# EAGLE schematic ESP32_MPU6050 (EAGLE 9.4.0)
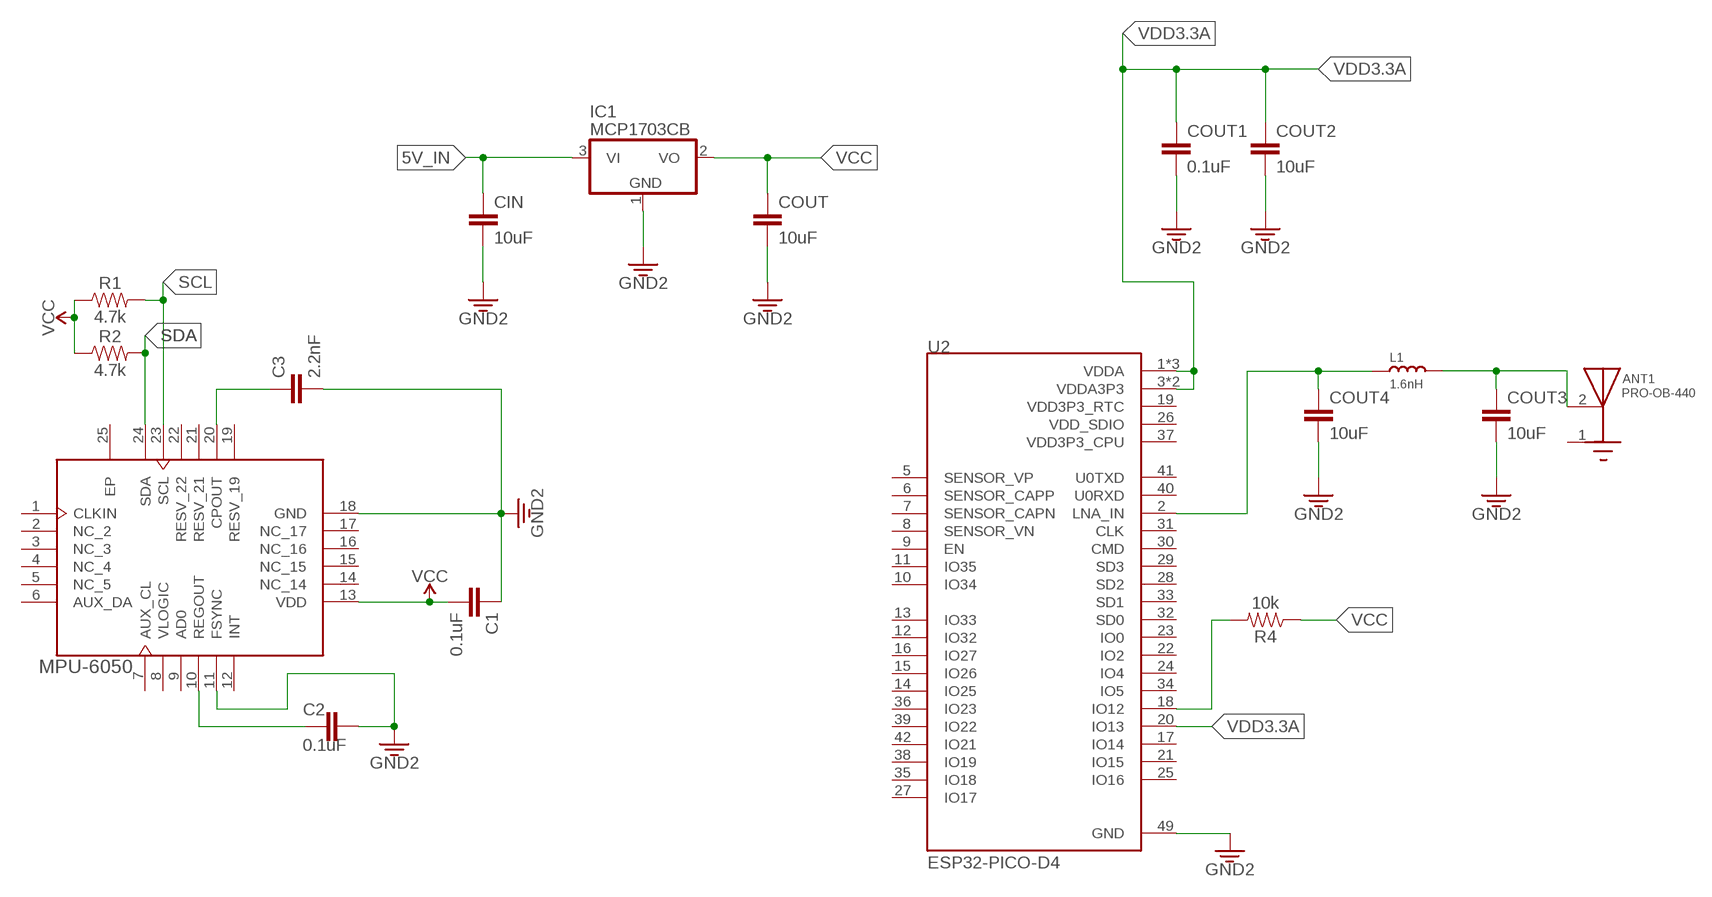
[diagram p0: schematic, sheet 1]

## Parts
ANT1  PRO-OB-440  [ANT_PRO-OB-440]
C1  0.1uF  0.1UF-0603-100V-10%  [0603]
C2  0.1uF  0.1UF-0603-100V-10%  [0603]
C3  2.2nF  2.2NF/2200PF-0603-50V-10%  [0603]
CIN  10uF  0.1UF-0603-100V-10%  [0603]
COUT  10uF  0.1UF-0603-100V-10%  [0603]
COUT1  0.1uF  0.1UF-0603-100V-10%  [0603]
COUT2  10uF  0.1UF-0603-100V-10%  [0603]
COUT3  10uF  0.1UF-0603-100V-10%  [0603]
COUT4  10uF  0.1UF-0603-100V-10%  [0603]
IC1  MCP1703CB  [SOT23]
L1  1.6nH  INDUCTOR_INDUCTOR/FERRITE-BEAD0603  [INDUCTOR_L0603]
R1  4.7k  4.7KOHM-0603-1/10W-1%  [0603]
R2  4.7k  4.7KOHM-0603-1/10W-1%  [0603]
R4  10k  4.7KOHM-0603-1/10W-1%  [0603]
U1  MPU-6050  [24-VFQFN]
U2  ESP32-PICO-D4  [PQFN50P700X700X104-49N]

## Nets
3.3V: C1.1 C2.2 C3.2 CIN.2 COUT1.2 COUT2.2 COUT3.2 COUT4.2 COUT.2 IC1.1(GND) U1.11(FSYNC) U1.18(GND) U2.49(GND) ; supply symbol labelled GND2
5V_IN: CIN.1 IC1.3(VI)
N$1: C3.1 U1.20(CPOUT)
N$2: COUT4.1 L1.1 U2.2(LNA_IN)
N$3: C2.1 U1.10(REGOUT)
N$4: ANT1.2(FEED) COUT3.1 L1.2
N$5: R4.2 U2.18(IO12)
SCL: R1.2 U1.23(SCL)
SDA: R2.2 U1.24(SDA)
VCC: COUT.1 IC1.2(VO) R1.1 R2.1 R4.1
VCC_3.3: C1.2 U1.13(VDD) ; supply symbol labelled VCC
VDD3.3A: COUT1.1 COUT2.1 U2.1(VDDA) U2.3(VDDA3P3) U2.4(VDDA3P3) U2.20(IO13) U2.43(VDDA) U2.46(VDDA)
Unconnected: U1.1(CLKIN) U1.2(NC_2) U1.3(NC_3) U1.4(NC_4) U1.5(NC_5) U1.6(AUX_DA) U1.7(AUX_CL) U1.9(AD0) U1.12(INT) U1.14(NC_14) U1.15(NC_15) U1.16(NC_16) U1.17(NC_17) U1.19(RESV_19) U1.21(RESV_21) U1.22(RESV_22) U2.5(SENSOR_VP) U2.6(SENSOR_CAPP) U2.7(SENSOR_CAPN) U2.8(SENSOR_VN) U2.9(EN) U2.10(IO34) U2.11(IO35) U2.12(IO32) U2.13(IO33) U2.14(IO25) U2.15(IO26) U2.16(IO27) U2.17(IO14) U2.21(IO15) U2.22(IO2) U2.23(IO0) U2.24(IO4) U2.25(IO16) U2.27(IO17) U2.28(SD2) U2.29(SD3) U2.30(CMD) U2.31(CLK) U2.32(SD0) U2.33(SD1) U2.34(IO5) U2.35(IO18) U2.36(IO23) U2.38(IO19) U2.39(IO22) U2.40(U0RXD) U2.41(U0TXD) U2.42(IO21)

## Power pins joined to a net without a drawn wire
EP: U1.25(EP)
GND: ANT1.1(GND)
VDD3P3_CPU: U2.37(VDD3P3_CPU)
VDD3P3_RTC: U2.19(VDD3P3_RTC)
VDD_SDIO: U2.26(VDD_SDIO)
VLOGIC: U1.8(VLOGIC)

## Library data of the parts
ANT1 = PRO-OB-440:PRO-OB-440: Ic Antenna Onboard 2400 Smd; AVAILABILITY: Unavailable; DESCRIPTION: Ic Antenna Onboard 2400 Smd; MF: Proant AB; MP: PRO-OB-440; PACKAGE: None; PRICE: None
C1 C2 COUT1 = SparkFun-Capacitors:0.1UF: 0.1µF ceramic capacitors A capacitor is a passive two-terminal electrical component used to store electrical energy temporarily in an electric field.; PROD_ID: CAP-08390
C3 = SparkFun-Capacitors:2.2NF/2200PF: 2.2nF/2,200pF ceramic capacitors A capacitor is a passive two-terminal electrical component used to store electrical energy temporarily in an electric field.; PROD_ID: CAP-07877
CIN COUT COUT2-COUT4 = SparkFun-Capacitors:0.1UF: 0.1µF ceramic capacitors A capacitor is a passive two-terminal electrical component used to store electrical energy temporarily in an electric field.; PROD_ID: CAP-08390; VALUE: 0.1uF
IC1 = linear:MCP1703: 250 mA, 16V, Low Quiescent Current LDO Regulator Source: http://ww1.microchip.com/downloads/en/DeviceDoc/22049b.pdf
L1 = BeagleBone_Blue_R3:INDUCTOR_INDUCTOR/FERRITE-BEAD
R1 R2 = SparkFun-Resistors:4.7KOHM: 4.7kΩ resistor A resistor is a passive two-terminal electrical component that implements electrical resistance as a circuit element. Resistors act to reduce current flow, and, at the same time, act to lower voltage levels within circuits. - Wikipedia; PROD_ID: RES-07857
R4 = SparkFun-Resistors:4.7KOHM: 4.7kΩ resistor A resistor is a passive two-terminal electrical component that implements electrical resistance as a circuit element. Resistors act to reduce current flow, and, at the same time, act to lower voltage levels within circuits. - Wikipedia; PROD_ID: RES-07857; VALUE: 4.7k
U1 = Sensor:MPU-6050: IMU ACCEL/GYRO 3-AXIS I2C 24QFN Manufacturer's datasheet <https://store.invensense.com/datasheets/invensense/MPU-6050_DataSheet_V3%204.pdf>; CREATED_BY: PCBLayout.com; DIGIKEY_PART_NUMBER: 1428-1007-1-ND; MANUFACTURER: TDK InvenSense; MPN: MPU-6050; PACKAGE: 24-VFQFN
U2 = ESP32-PICO-D4:ESP32-PICO-D4: The ESP32-PICO-D4 is a System-in-Package (SIP) module that is based on ESP32, providing complete Wi-Fi and Bluetooth functionalities. The module has a size as small as 7.0±0.1 mm×7.0±0.1 mm×0.94±0.1 mm, thus requiring minimal PCB area. The module integrates a 4-MB SPI flash; AVAILABILITY: Unavailable; DESCRIPTION: WIFi/Bluetooth SIP; MF: Espressif Systems; MP: ESP32-PICO-D4; PACKAGE: SMD-48 Espressif Systems; PRICE: None